# EAGLE design bitsyled-v1.2.1 (EAGLE 9.3.2)
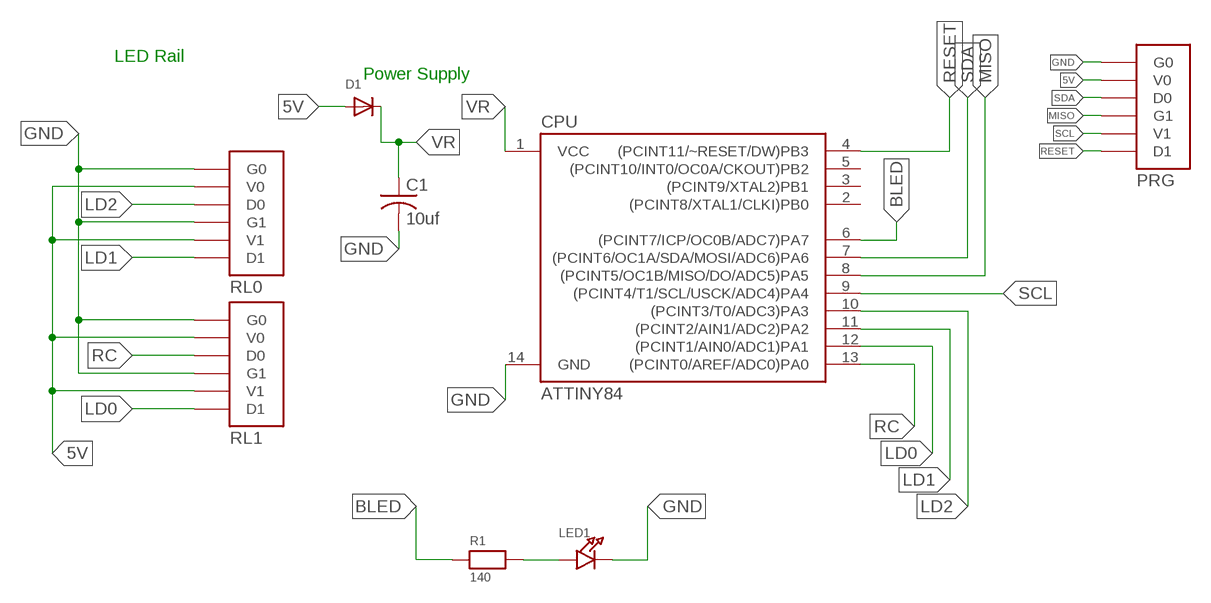
[diagram p0: schematic, sheet 1]

## Parts
C1  10uf  C-USC0805  [C0805]
CPU  ATTINY84  [SO14]
D1  DIODESOD-123  [SOD-123]
LED1  LED0805_NOOUTLINE  [CHIPLED_0805_NOOUTLINE]
PRG  BITSYLED_1X6_RAILPRG  [BITSYLED_1X6_RAIL_PRG]
R1  140  RESISTOR_0805  [_0805]
RL0  BITSYLED_1X6_RAILNORMAL  [BITSYLED_1X6_RAIL]
RL1  BITSYLED_1X6_RAILREVERSED  [BITSYLED_1X6_RAIL_R]

## Nets
5V: D1.A PRG.V0 RL0.V0 RL0.V1 RL1.V0 RL1.V1
BLED: CPU.6((PCINT7/ICP/OC0B/ADC7)PA7) R1.1
GND: C1.2 CPU.14(GND) LED1.C PRG.G0 RL0.G0 RL0.G1 RL1.G0 RL1.G1
LD0: CPU.12((PCINT1/AIN0/ADC1)PA1) RL1.D1
LD1: CPU.11((PCINT2/AIN1/ADC2)PA2) RL0.D1
LD2: CPU.10((PCINT3/T0/ADC3)PA3) RL0.D0
MISO: CPU.8((PCINT5/OC1B/MISO/DO/ADC5)PA5) PRG.G1
N$2: LED1.A R1.2
RC: CPU.13((PCINT0/AREF/ADC0)PA0) RL1.D0
RESET: CPU.4((PCINT11/~RESET/DW)PB3) PRG.D1
SCL: CPU.9((PCINT4/T1/SCL/USCK/ADC4)PA4) PRG.V1
SDA: CPU.7((PCINT6/OC1A/SDA/MOSI/ADC6)PA6) PRG.D0
VR: C1.1 CPU.1(VCC) D1.C
Unconnected: CPU.2((PCINT8/XTAL1/CLKI)PB0) CPU.3((PCINT9/XTAL2)PB1) CPU.5((PCINT10/INT0/OC0A/CKOUT)PB2)

## Notes on the sheet
- LED Rail
- Power Supply

## Library data of the parts
C1 = adafruit:C-US: CAPACITOR, American symbol
CPU = SparkFun-IC-Microcontroller:ATTINY84: Atmel 14-pin 2/4/8kB flash uC Datasheet <https://cdn.sparkfun.com/datasheets/Widgets/doc8006.pdf> SparkFun Products Tiny AVR Programmer <https://www.sparkfun.com/products/11801> (PGM-11801) SparkFun Servo Trigger - Continuous Rotation <https://www.sparkfun.com/products/13872> (WIG-13872) SparkFun Servo Trigger <https://www.sparkfun.com/products/13118> (WIG-13118); PROD_ID: IC-11285
D1 = adafruit:DIODE: Diode SMADIODE - SMA Surface Mount Package 20V 1A Schottky Diode Digikey: 641-1014-6-ND DO-1N4148 - Through Hole Small Current Diode SOD-123 20V 1 A (.5mV Vf) Schottky Diode - Digikey: MBRX120TPMSCT-ND SOD-323 10V 570mA (.38mV Vf, 3ns) Schottky Diode - Digikey: ZLLS410CT-ND SOD-523 30V 30mA Schottky Diode (RB751S-40TE61) - Digikey: RB751S-40TE61CT-ND SOT23-R/W - SOT23 Package (R = Solder Paste/Reflow Ovens, W = Hand-Soldering) BAT54Film 40V 300mA - Digikey: 497-7162-1-ND
LED1 = microbuilder:LED: LED 0603 - 0603 Surface Mount Package 2mA: Green LED - Low Power (3.9mcd, 2ma, 1.7Vf) - Digikey: 475-2709-2-ND Orange LED - Low Power (9.8mcd, 2ma, 1.8Vf) - Digikey: 475-1194-2-ND Red LED - Low Power (5mcd, 2ma, 1.8Vf) - Digikey: 475-1195-2-ND Yellow LED - Low Power (7mcd, 2ma, 1.8Vf) - Digikey: 475-1196-2-ND 5mA: Blue LED - Low Power (17mcd, 5ma, 2.9Vf) - Digikey: LNJ937W8CRACT-ND 0805 - 0805 Surface Mount Package 2mA: Red LED (8.8mcd, 2mA, 1.8Vf, Clear) - Low Power [Digikey: 475-2510-1-ND] Green LED (5mcd, 2mA, 1.8Vf, Clear) - Low Power [Digikey: 475-2730-1-ND] Yellow LED (11.3mcd, 2mA, 1.8Vf, Clear) - Low Power [Digikey: 475-2555-1-ND] 20mA: Red LED (104mcd, 20mA, Diffused) - LS R976 [Digikey: 475-1278-6-ND] Red LED (12mcd, 20mA, 2.0Vf, Clear) - APT2012EC [Digikey: 754-1128-1-ND] Green LED (15mcd, 20mA, 2.2Vf, Clear) - APT2012GC [Digikey: 754-1131-1-ND] Orange LED (160mcd, 20mA, 2.1Vf, Clear) - APT2012SECK [Digikey: 754-1130-1-ND] 1206 - 1206 Surface Mount Package Green LED (26mcd, 20mA, Diffused) - LG N971 [Digikey: 475-1407-6-ND] Red LED (15mcd, 20mA, Diffused) - LH N974 [Digikey: 475-1416-6-ND]
PRG RL0 RL1 = FPVTools:BITSYLED_1X6_RAIL
R1 = microbuilder:RESISTOR: Resistors 0402 - 0402 Surface Mount Package 22 Ohm 1% 1/16W [Digikey: 311-22.0LRTR-ND] 33 Ohm 5% 1/16W 1.0K 5% 1/16W 1.5K 5% 1/16W 2.0K 1% 1/16W 10.0K 1% 1/16W [Digikey: 311-10.0KLRTR-ND] 10.0K 5% 1/16W [Digikey: RMCF0402JT10K0TR-ND] 12.1K 1% 1/16W [Digikey: 311-22.0LRTR-ND] 100.0K 5% 1/16W 0603 - 0603 Surface Mount Package 0 Ohm 1/10 Watt 1% Resistor 15 Ohm 1/10 Watt 1% Resistor 33 Ohm 1/10 Watt 1% Resistor 49.9 Ohm 1/10 Watt 1% Resistor 100 Ohm 1/10 Watt 1% Resistor 150 Ohm 1/10 Watt 1% Resistor 240 Ohm 1/10 Watt 1% Resistor 390 Ohm 1/10 Watt 1% Resistor 560 Ohm 1/10 Watt 1% Resistor 680 Ohm 1/10 Watt 1% Resistor 750 Ohm 1/10 Watt 1% Resistor 1.0K Ohm 1/10 Watt 1% Resistor 1.5K Ohm 1/10 Watt 1% Resistor 2.0K Ohm 1/10 Watt 1% Resistor 2.2K Ohm 1/10 Watt 1% Resistor 3.3K Ohm 1/10 Watt 1% Resistor 4.7K Ohm 1/10 Watt 1% Resistor 10.0K Ohm 1/10 Watt 1% Resistor 12.0K Ohm 1/10 Watt 1% Resistor 12.1K Ohm 1/10 Watt 1% Resistor 20.0K Ohm 1/10 Watt 1% Resistor 33.0K Ohm 1/10 Watt 1% Resistor 100.0K Ohm 1/10 Watt 1% Resistor 0805 - 0805 Surface Mount Package 0 Ohm 1/8 Watt 1% Resistor 33 Ohm 1/8 Watt 1% Resistor 100 Ohm 1/8 Watt 1% Resistor 150 Ohm 1/8 Watt 1% Resistor 200 Ohm 1/8 Watt 1% Resistor 240 Ohm 1/8 Watt 1% Resistor 330 Ohm 1/8 Watt 1% Resistor 390 Ohm 1/8 Watt 1% Resistor 470 Ohm 1/8 Watt 1% Resistor 1.0K Ohm 1/8 Watt 1% Resistor 1.5K Ohm 1/8 Watt 1% Resistor 2.0K Ohm 1/8 Watt 1% Resistor 4.7K Ohm 1/8 Watt 1% Resistor 5.1K Ohm 1/8 Watt 1% Resistor 5.6K Ohm 1/8 Watt 1% Resistor 10.0K Ohm 1/8 Watt 1% Resistor 22.0K Ohm 1/8 Watt 1% Resistor 33.0K Ohm 1/8 Watt 1% Resistor 100K Ohm 1/8 Watt 1% Resistor 1206 - 1206 Surface Mount Package 2012 - 2010 Surface Mount Package 0.11 Ohm 1/2 Watt 1% Resistor - Digikey: RHM.11UCT-ND

## Net classes
0 default: width 0.152 mm, drill 0.152 mm, clearance 0.127 mm

## Board
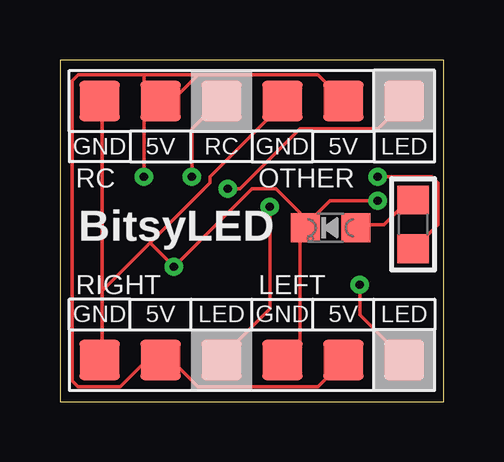
[diagram p1: board, top side]
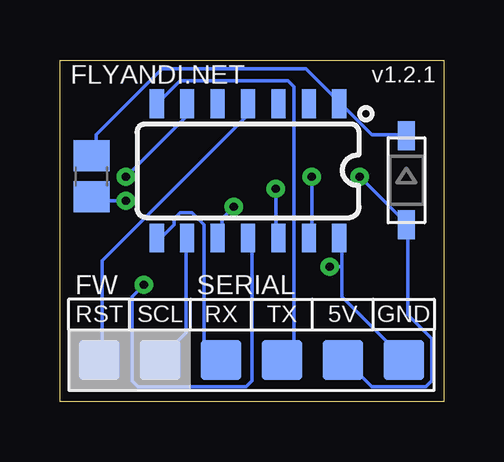
[diagram p2: board, bottom side, seen from below]

Size 16 x 14.23 mm. Coordinates in mm from the lower left corner, seen from the top.
Outline: 0,0 16,0 16,14.23 0,14.23 0,0
Copper layers (1*16): Top 0.035mm / dielectric 1.5mm / Bottom 0.035mm
Design rules "default *": minimum track width 6mil, minimum drill 0.35mm, track to track 6mil, track to pad 6mil, pad to pad 6mil, via to via 6mil, smd to smd 6mil, copper to edge 5mil, drill to drill 6mil, minimum pad ring 10mil, minimum via ring 8mil, stop-mask expansion 4mil, vias tented up to drill 0mil, thermal gap 10mil
vRestrict: area 0.8,6.4 to 7.9,8.1

### Footprints (pad centres in the part's own frame; a part is rotated, then mirrored left to right if it is on the bottom)
C0805 = smd 1.3 x 1.5: 1 -0.85,0; 2 0.85,0
SO14 = smd 0.6 x 1.2: 1 -3.175,-2.8; 2 -1.905,-2.8; 3 -0.635,-2.8; 4 0.635,-2.8; 5 1.905,-2.8; 6 3.175,-2.8; 7 4.445,-2.8; 8 4.445,2.8; 9 3.175,2.8; 10 1.905,2.8; 11 0.635,2.8; 12 -0.635,2.8; 13 -1.905,2.8; 14 -3.175,2.8
SOD-123 = smd 1.2 x 0.7: A 1.85,0; C -1.85,0
CHIPLED_0805_NOOUTLINE = smd 1.2 x 1.2: A 0,-1.05; C 0,1.05
BITSYLED_1X6_RAIL_PRG = smd 1.676 x 1.676 bottom: D0 -8.89,-1.27; D1 -1.27,-1.27; G0 -13.97,-1.27; G1 -6.35,-1.27; V0 -11.43,-1.27; V1 -3.81,-1.27
_0805 = smd 1.2 x 1.3: 1 -1.016,0; 2 1.016,0
BITSYLED_1X6_RAIL = smd 1.676 x 1.676: D0 -8.89,-1.27; D1 -1.27,-1.27; G0 -13.97,-1.27; G1 -6.35,-1.27; V0 -11.43,-1.27; V1 -3.81,-1.27
BITSYLED_1X6_RAIL_R = smd 1.676 x 1.676: D0 -8.89,0; D1 -1.27,0; G0 -13.97,0; G1 -6.35,0; V0 -11.43,0; V1 -3.81,0

### Placement (x,y rotation side)
C1  14.68,9.39 270 bottom
CPU  7.52,9.61 180 bottom
D1  1.55,9.22 270 bottom
LED1  11.29,7.24 90 top
PRG  15.63,3 0 top
R1  14.73,7.38 90 top
RL0  15.63,3 0 top
RL1  15.63,12.53 0 top

### Tracks (layer width: path | path; a pad name or v marks a point on that pad's centre or on a via)
5V  (via drill 0.35)
  Top 0.152: RL0.V1 11.75,1.61 10.75,0.61 5.75,0.61 4.75,1.61 4.25,1.61 PRG.V0 4,1.61 3.5,1.61 2.5,0.61 0.75,0.61 0.5,0.86 0.5,13.37 0.75,13.62 3.5,13.62 | 5.75,13.62 4.75,12.62 4.25,12.62 RL1.V0 | 5.75,13.62 10.75,13.62 11.75,12.62 RL1.V1 | 5.75,13.62 3.5,13.62 | 3.5,13.62 v3.5,9.37
  Bottom 0.152: PRG.V0 4,1.61 3,0.61 0.75,0.61 0.5,0.86 0.5,2.62 1.5,3.62 1.5,7.37 D1.A 1.75,7.62 v3.5,9.37
BLED  (via drill 0.35)
  Top 0.152: v13.25,9.37 15.5,9.37 15.75,9.12 15.75,7.37 14.75,6.37 R1.1
  Bottom 0.152: v13.25,9.37 10.75,11.87 10.75,12.37 CPU.6
GND  (via drill 0.35)
  Top 0.152: LED1.C 10,7.12 10,2.37 9.5,1.86 RL0.G1 | v13.25,8.37 11.25,8.37 10.25,7.37 LED1.C | 1.75,4.62 1.75,12.37 RL1.G0 | 1.75,4.62 1.75,1.86 PRG.G0 | 1.75,4.62 3.75,6.62 | 3.75,6.62 6.25,9.12 6.25,9.37 9.25,12.37 RL1.G1 | 3.75,6.62 v4.75,5.62 8,8.87 9,8.87 10,7.87 10,7.37 LED1.C
  Bottom 0.152: v13.25,8.37 14.5,8.37 C1.2 | 4.25,5.62 4.25,4.37 1.75,1.86 PRG.G0 | 4.25,5.62 4.25,6.62 CPU.14 | v4.75,5.62 4.25,5.62
LD0  (via drill 0.35)
  Top 0.152: v7,8.87 7.5,8.87 10,11.37 13.25,11.37 14.25,12.37 RL1.D1
  Bottom 0.152: v7,8.87 7,6.87 CPU.12
LD1  (via drill 0.35)
  Top 0.152: v12.5,4.87 12.5,3.62 14.25,1.86 RL0.D1
  Bottom 0.152: v12.5,4.87 13,4.37 13,0.86 12.75,0.61 8.25,0.61 8,0.86 8,6.62 CPU.11
LD2  (via drill 0.35)
  Top 0.152: v8.75,8.12 8.75,3.87 6.75,1.86 RL0.D0
  Bottom 0.152: v8.75,8.12 9.25,7.62 9.25,6.87 CPU.10
MISO
  Bottom 0.152: CPU.8 11.75,6.87 11.25,7.37 11.25,7.62 11,7.87 10.5,7.87 10,7.37 10,2.37 9.5,1.86 PRG.G1
N$2
  Top 0.152: LED1.A 12.5,7.37 13.5,7.37 14.5,8.37 R1.2
RC  (via drill 0.35)
  Top 0.152: v5.5,9.37 5.5,11.37 6.5,12.37 RL1.D0
  Bottom 0.152: v5.5,9.37 5.5,6.87 CPU.13
RESET
  Bottom 0.152: CPU.4 8.25,12.37 8.25,11.87 14.25,5.87 14.25,1.86 PRG.D1
SCL
  Bottom 0.152: CPU.9 10.75,6.62 10.75,2.87 11.75,1.86 PRG.V1
SDA
  Bottom 0.152: CPU.7 11.75,12.62 11,13.37 6.5,13.37 6.25,13.12 6.25,2.12 6.5,1.86 PRG.D0
VR
  Bottom 0.152: D1.C 1.75,11.12 3,11.12 4.25,12.37 CPU.1 4.5,12.62 5.75,13.87 11.75,13.87 14.5,11.12 14.5,10.37 C1.1

### Text on the board
tPlace: BitsyLED
bPlace: v1.2.1 | FLYANDI.NET